# EAGLE design 712_universal_i2c_long (EAGLE 9.6.2)
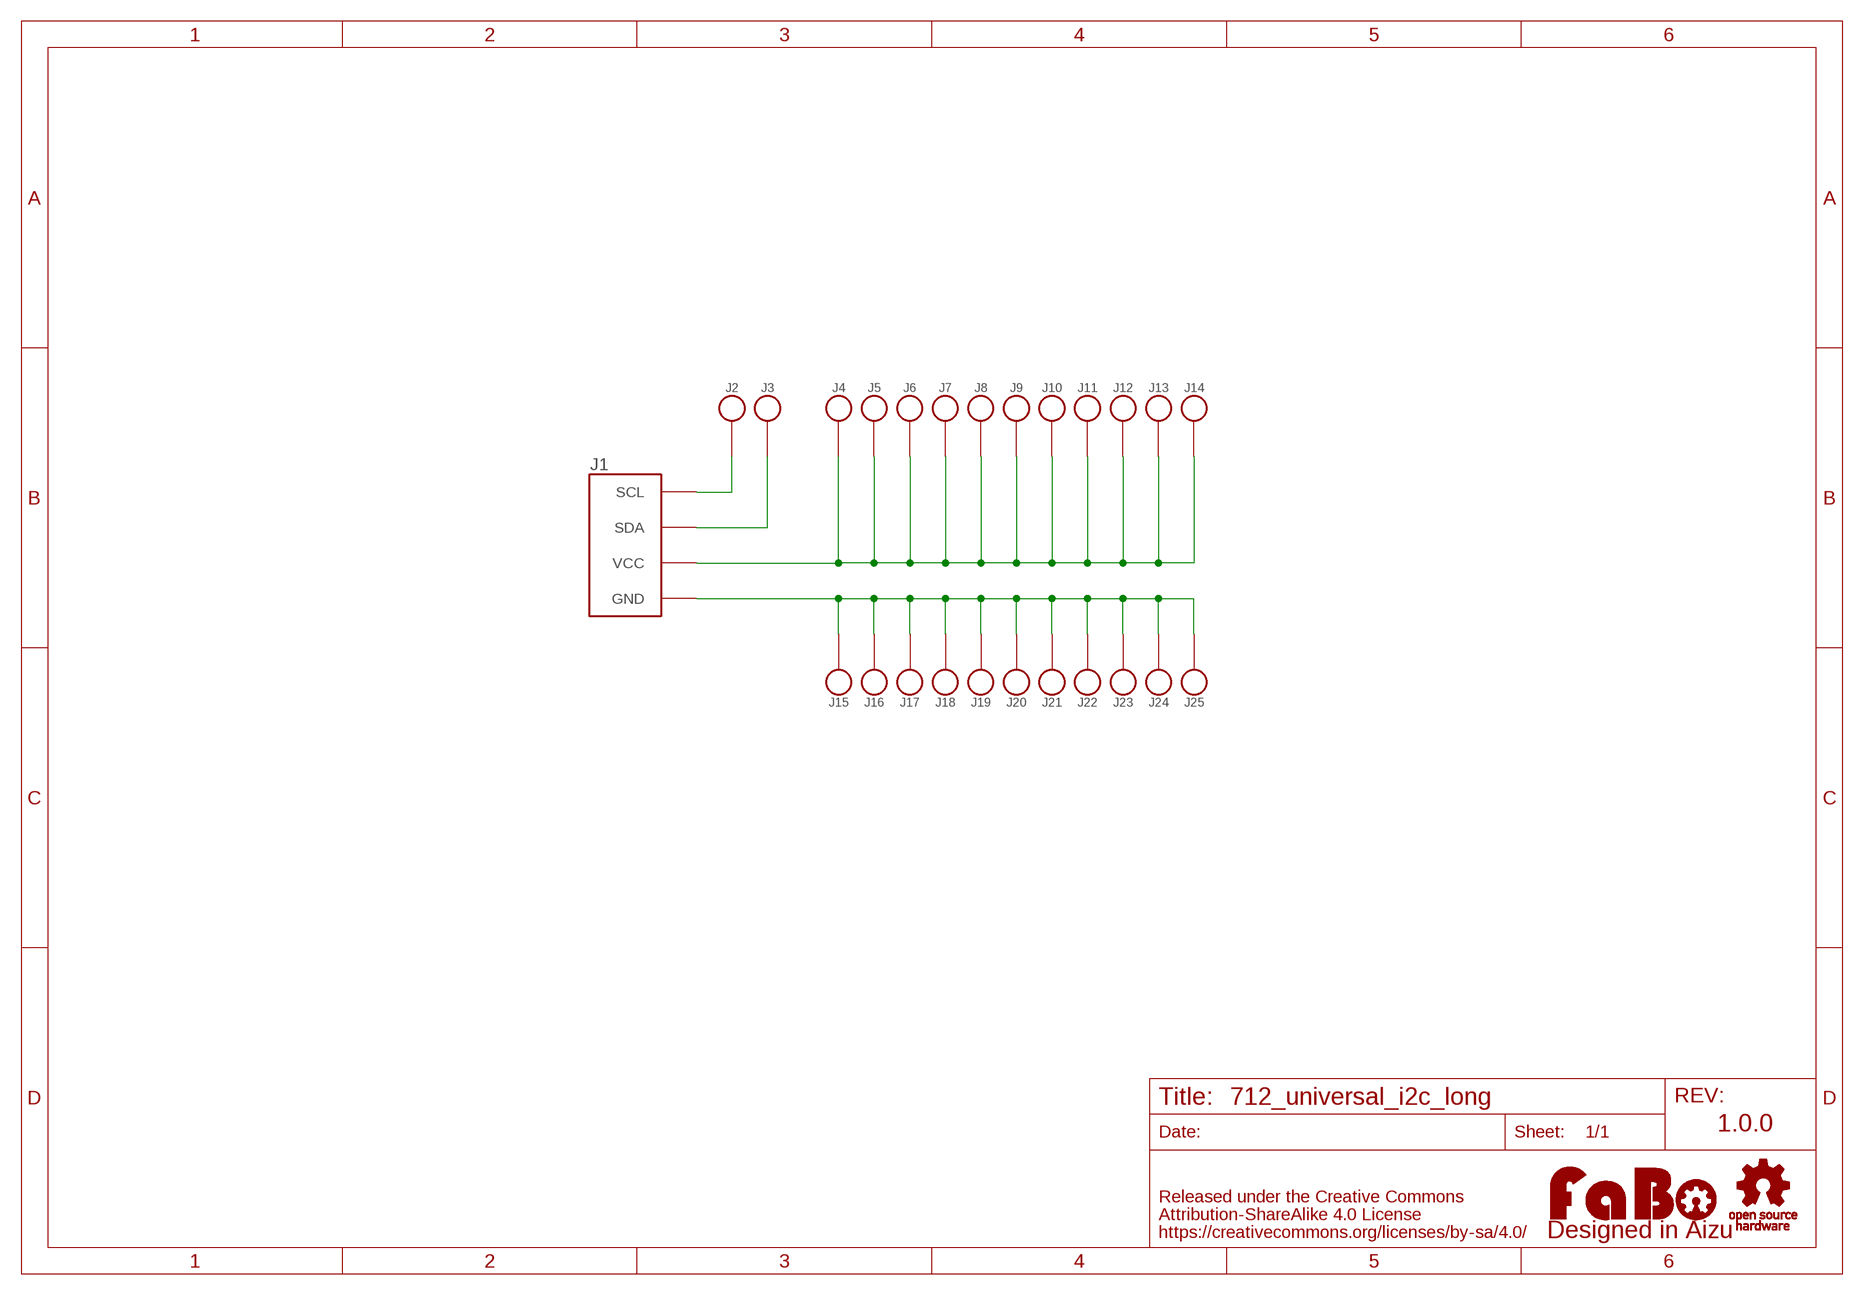
[diagram p0: schematic, sheet 1]

## Parts
J1  FABO_BRICK_I2C-UNIVERSAL_LONG  [FABO_BRICK_I2C_UNIVERSAL_LONG]
J2  PIN_HEADER_1X1_NOLABEL  [PIN_1X1_NOLABEL]
J3  PIN_HEADER_1X1_NOLABEL  [PIN_1X1_NOLABEL]
J4  PIN_HEADER_1X1_NOLABEL  [PIN_1X1_NOLABEL]
J5  PIN_HEADER_1X1_NOLABEL  [PIN_1X1_NOLABEL]
J6  PIN_HEADER_1X1_NOLABEL  [PIN_1X1_NOLABEL]
J7  PIN_HEADER_1X1_NOLABEL  [PIN_1X1_NOLABEL]
J8  PIN_HEADER_1X1_NOLABEL  [PIN_1X1_NOLABEL]
J9  PIN_HEADER_1X1_NOLABEL  [PIN_1X1_NOLABEL]
J10  PIN_HEADER_1X1_NOLABEL  [PIN_1X1_NOLABEL]
J11  PIN_HEADER_1X1_NOLABEL  [PIN_1X1_NOLABEL]
J12  PIN_HEADER_1X1_NOLABEL  [PIN_1X1_NOLABEL]
J13  PIN_HEADER_1X1_NOLABEL  [PIN_1X1_NOLABEL]
J14  PIN_HEADER_1X1_NOLABEL  [PIN_1X1_NOLABEL]
J15  PIN_HEADER_1X1_NOLABEL  [PIN_1X1_NOLABEL]
J16  PIN_HEADER_1X1_NOLABEL  [PIN_1X1_NOLABEL]
J17  PIN_HEADER_1X1_NOLABEL  [PIN_1X1_NOLABEL]
J18  PIN_HEADER_1X1_NOLABEL  [PIN_1X1_NOLABEL]
J19  PIN_HEADER_1X1_NOLABEL  [PIN_1X1_NOLABEL]
J20  PIN_HEADER_1X1_NOLABEL  [PIN_1X1_NOLABEL]
J21  PIN_HEADER_1X1_NOLABEL  [PIN_1X1_NOLABEL]
J22  PIN_HEADER_1X1_NOLABEL  [PIN_1X1_NOLABEL]
J23  PIN_HEADER_1X1_NOLABEL  [PIN_1X1_NOLABEL]
J24  PIN_HEADER_1X1_NOLABEL  [PIN_1X1_NOLABEL]
J25  PIN_HEADER_1X1_NOLABEL  [PIN_1X1_NOLABEL]
U$2  LOGO_OSHW-M_BOTTOM  [LOGO_OSHW_M_BOTTOM]
U$3  LOGO_FABO-M  [LOGO_FABO_MS]

## Nets
GND: J1.GND J15.1 J16.1 J17.1 J18.1 J19.1 J20.1 J21.1 J22.1 J23.1 J24.1 J25.1
RX: J1.SCL J2.1
TX: J1.SDA J3.1
VCC: J1.VCC J4.1 J5.1 J6.1 J7.1 J8.1 J9.1 J10.1 J11.1 J12.1 J13.1 J14.1

## Notes on the sheet
- 1.0.0

## Library data of the parts
J1 = FaBo-Template:FABO_BRICK_I2C: FaBo Brick I2C
J2-J25 = FaBo-PIN:PIN_HEADER_1X1_NOLABEL
U$2 = FaBo-etc:LOGO_OSHW
U$3 = FaBo-Logo:LOGO_FABO

## Board
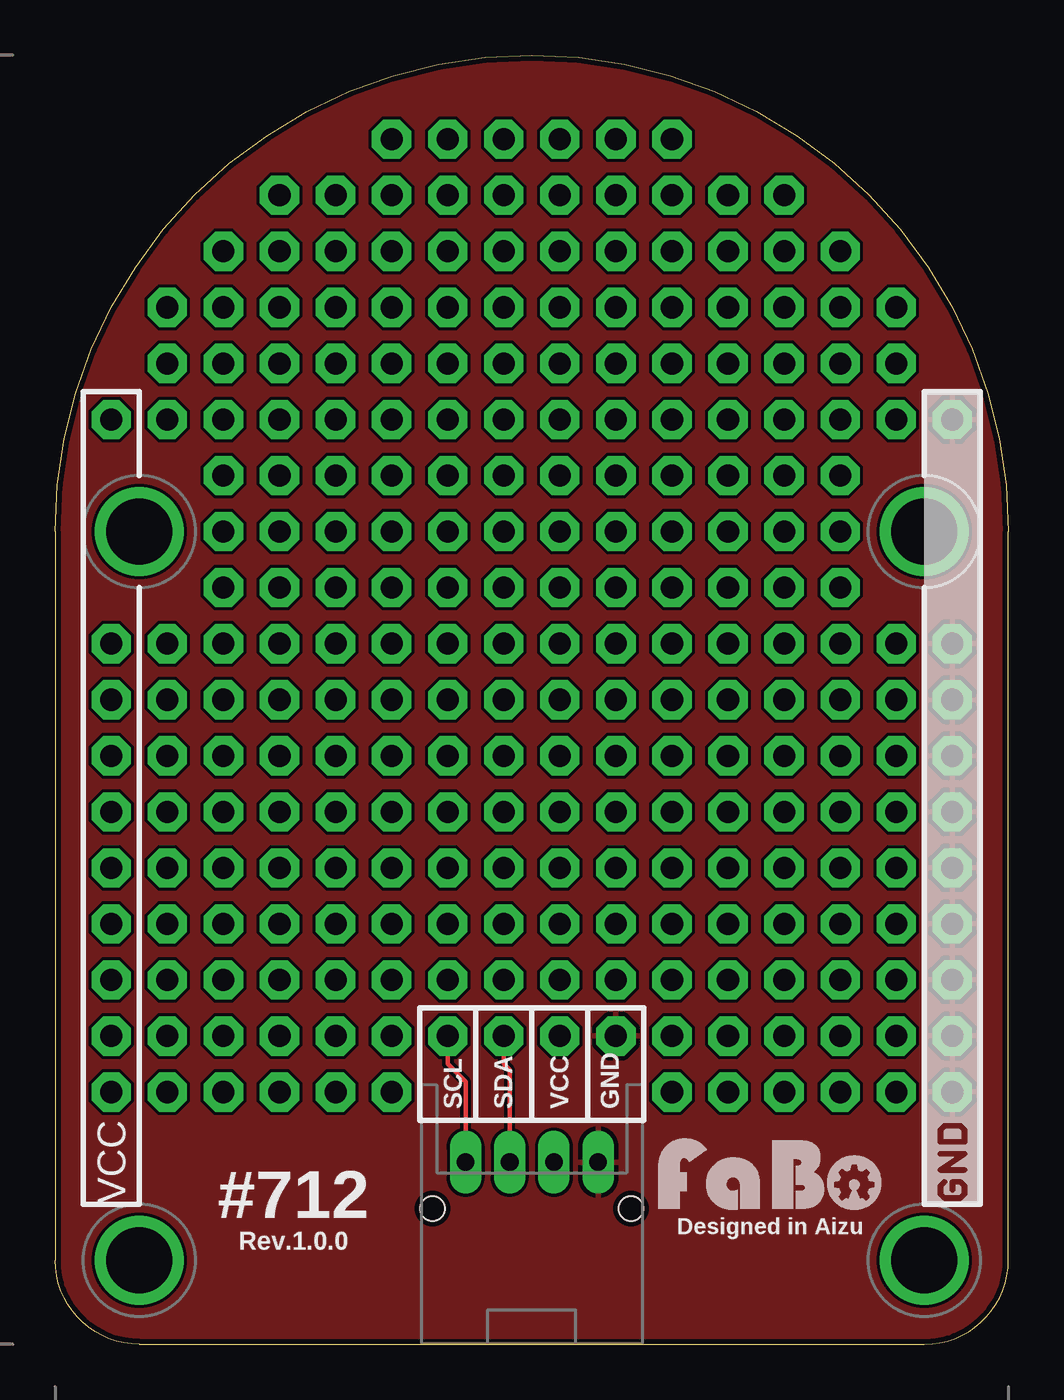
[diagram p1: board, top side]
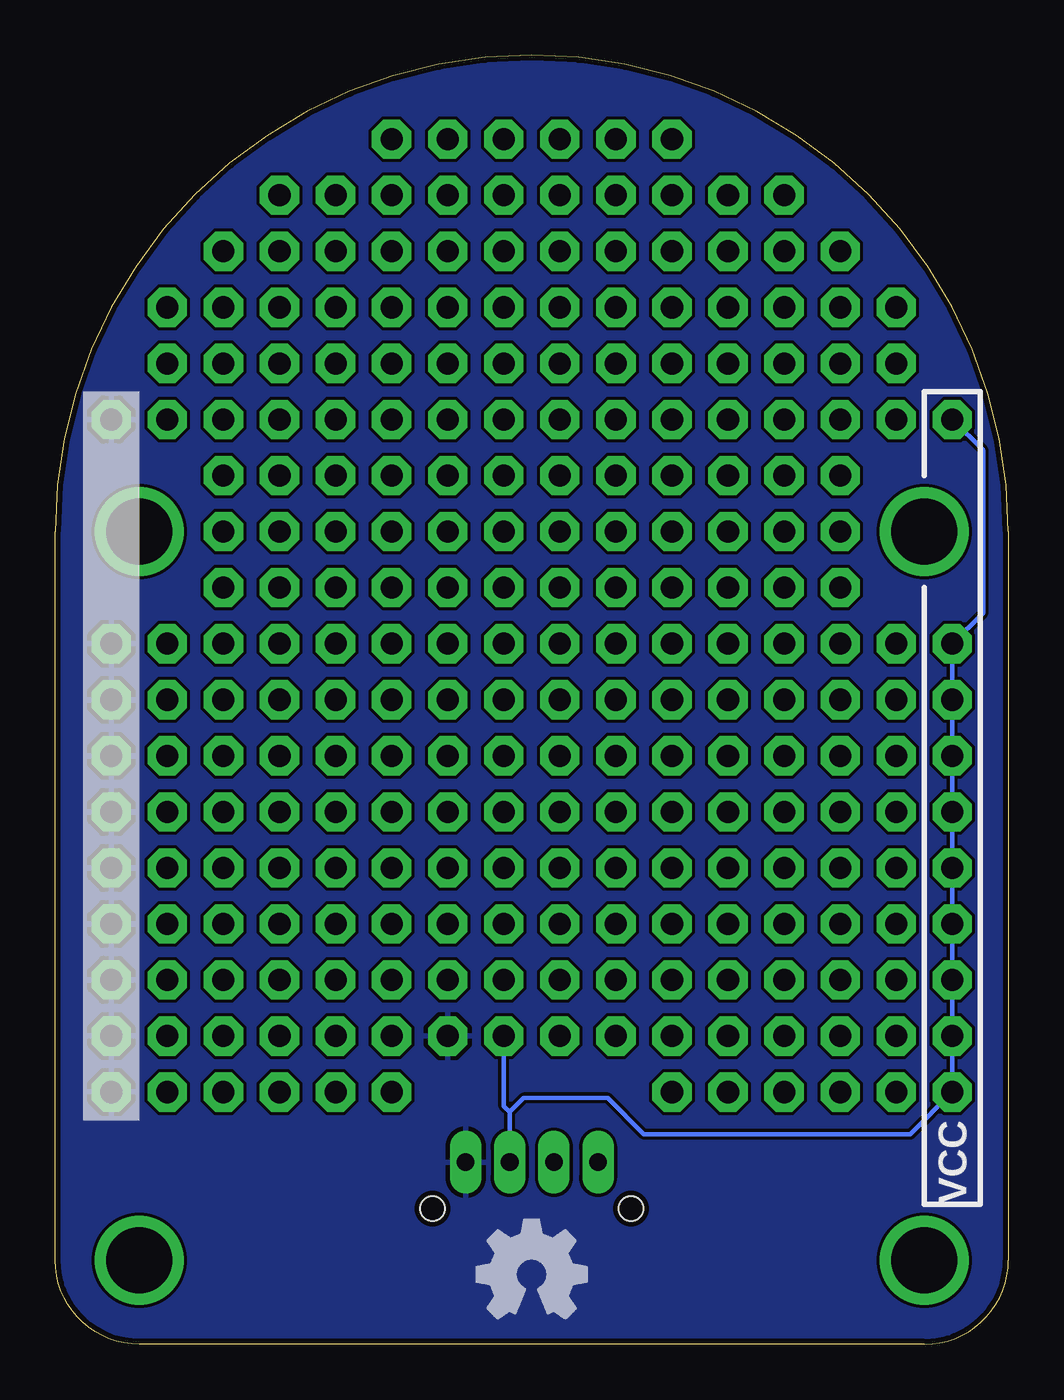
[diagram p2: board, bottom side, seen from below]

Size 43.18 x 58.42 mm. Coordinates in mm from the lower left corner, seen from the top.
Copper layers (1*16): Top 0.035mm / dielectric 1.6mm / Bottom 0.035mm
Design rules "PCBway": minimum track width 6mil, minimum drill 12mil, track to track 6mil, track to pad 6mil, pad to pad 6mil, via to via 6mil, smd to smd 6mil, copper to edge 10mil, drill to drill 10mil, minimum pad ring 10mil, minimum via ring 6mil, stop-mask expansion 2mil, vias tented up to drill 100mil, thermal gap 8mil

### Footprints (pad centres in the part's own frame; a part is rotated, then mirrored left to right if it is on the bottom)
FABO_BRICK_I2C_UNIVERSAL_LONG = drill 0.8 pad 1.422 long: GND 3,-20.955; SCL -3,-20.955; SDA -1,-20.955; VCC 1,-20.955 | drill 3 pad 3.81: P$1 -17.78,7.62; P$2 17.78,7.62; P$3 -17.78,-25.4; P$4 17.78,-25.4 | drill 1 pad 1.778 octagon: P$5 -13.97,-17.78; P$6 -6.35,-17.78; P$7 6.35,-5.08; P$8 8.89,-5.08; P$9 8.89,-2.54; P$10 -8.89,-17.78; P$11 -11.43,-15.24; P$12 -13.97,-15.24; P$13 13.97,-17.78; P$14 -11.43,-17.78; P$15 -8.89,-15.24; P$16 -6.35,-15.24; P$17 13.97,-15.24; P$18 13.97,-12.7; P$19 13.97,-10.16; P$20 13.97,-7.62; P$21 -13.97,-12.7; P$22 -13.97,-10.16; P$23 -13.97,-7.62; P$24 -11.43,-12.7; P$25 -11.43,-10.16; P$26 -11.43,-7.62; P$27 -8.89,-12.7; P$28 -8.89,-10.16; P$29 -8.89,-7.62; P$30 -6.35,-12.7; P$31 -3.81,-12.7; P$32 -1.27,-12.7; P$33 1.27,-12.7; P$34 13.97,-5.08; P$35 -6.35,-10.16; P$36 -3.81,-10.16; P$37 -1.27,-10.16; P$38 1.27,-10.16; P$39 13.97,-2.54; P$40 -6.35,-7.62; P$41 -3.81,-7.62; P$42 -1.27,-7.62; P$43 1.27,-7.62; P$44 1.27,0; P$45 -1.27,-5.08; P$46 -3.81,-5.08; P$47 -6.35,-5.08; P$48 -8.89,-5.08; P$49 -11.43,-5.08; P$50 -13.97,-5.08; P$51 -13.97,-2.54; P$52 -11.43,-2.54; P$53 -8.89,-2.54; P$54 -6.35,-2.54; P$55 -3.81,-2.54; P$56 -1.27,-2.54; P$57 8.89,-7.62; P$58 6.35,-7.62; P$59 3.81,0; P$60 8.89,-10.16; P$61 8.89,-12.7; P$62 8.89,-15.24; P$63 8.89,-17.78; P$64 -13.97,0; P$65 6.35,-10.16; P$66 6.35,0; P$67 6.35,-12.7; P$68 6.35,-15.24; P$69 6.35,-17.78; P$70 3.81,-7.62; P$71 3.81,-10.16; P$72 3.81,-12.7; P$73 13.97,0; P$74 6.35,-2.54; P$75 -8.89,0; P$76 1.27,-2.54; P$77 3.81,-2.54; P$78 3.81,-5.08; P$79 1.27,-5.08; P$80 -1.27,0; P$81 13.97,2.54; P$82 13.97,5.08; P$83 -11.43,0; P$84 -6.35,0; P$85 -3.81,0; P$86 13.97,7.62; P$87 8.89,0; P$88 -13.97,2.54; P$89 -13.97,5.08; P$90 -13.97,7.62; P$91 13.97,17.78; P$92 11.43,22.86; P$93 13.97,20.32; P$94 -11.43,2.54; P$95 -11.43,5.08; P$96 -11.43,7.62; P$97 -8.89,2.54; P$98 -8.89,5.08; P$99 -8.89,7.62; P$100 -6.35,2.54; P$101 -6.35,5.08; P$102 -6.35,7.62; P$103 -3.81,2.54; P$104 -3.81,5.08; P$105 -3.81,7.62; P$106 -1.27,2.54; P$107 -1.27,5.08; P$108 -1.27,7.62; P$109 1.27,2.54; P$110 1.27,5.08; P$111 1.27,7.62; P$112 3.81,2.54; P$113 3.81,5.08; P$114 3.81,7.62; P$115 6.35,2.54; P$116 6.35,5.08; P$117 6.35,7.62; P$118 8.89,2.54; P$119 8.89,5.08; P$120 8.89,7.62; P$121 6.35,10.16; P$122 6.35,12.7; P$123 6.35,15.24; P$124 6.35,17.78; P$125 6.35,20.32; P$126 6.35,22.86; P$127 8.89,15.24; P$128 8.89,17.78; P$129 8.89,20.32; P$130 3.81,10.16; P$131 3.81,12.7; P$132 3.81,15.24; P$133 3.81,17.78; P$134 3.81,20.32; P$135 3.81,22.86; P$136 -6.35,10.16; P$137 1.27,10.16; P$138 1.27,12.7; P$139 1.27,15.24; P$140 1.27,17.78; P$141 1.27,20.32; P$142 1.27,22.86; P$143 1.27,25.4; P$144 -1.27,10.16; P$145 -1.27,12.7; P$146 -1.27,15.24; P$147 -1.27,17.78; P$148 -1.27,20.32; P$149 -1.27,22.86; P$150 -1.27,25.4; P$151 -3.81,10.16; P$152 -3.81,12.7; P$153 -3.81,15.24; P$154 -3.81,17.78; P$155 -3.81,20.32; P$156 -3.81,22.86; P$157 -3.81,25.4; P$158 -6.35,12.7; P$159 -6.35,15.24; P$160 -6.35,17.78; P$161 -6.35,20.32; P$162 -6.35,22.86; P$163 -6.35,25.4; P$164 -8.89,10.16; P$165 -8.89,12.7; P$166 -8.89,15.24; P$167 -8.89,17.78; P$168 -8.89,20.32; P$169 -8.89,22.86; P$170 13.97,10.16; P$171 -11.43,10.16; P$172 -11.43,12.7; P$173 -11.43,15.24; P$174 -11.43,17.78; P$175 -11.43,20.32; P$176 13.97,12.7; P$177 -13.97,10.16; P$178 -13.97,12.7; P$179 -13.97,15.24; P$180 -13.97,17.78; P$181 13.97,15.24; P$182 11.43,2.54; P$183 -13.97,20.32; P$184 -11.43,22.86; P$185 11.43,-5.08; P$186 11.43,-17.78; P$187 16.51,-17.78; P$188 11.43,15.24; P$189 11.43,-12.7; P$190 11.43,17.78; P$191 11.43,-15.24; P$192 11.43,20.32; P$193 11.43,-2.54; P$194 11.43,7.62; P$195 11.43,-10.16; P$196 11.43,5.08; P$197 11.43,-7.62; P$198 8.89,12.7; P$199 11.43,12.7; P$200 8.89,10.16; P$201 11.43,10.16; P$202 8.89,22.86; P$203 11.43,0; P$204 3.81,25.4; P$205 6.35,25.4; P$206 16.51,-15.24; P$207 16.51,-12.7; P$208 16.51,-10.16; P$209 16.51,-7.62; P$210 16.51,-5.08; P$211 16.51,-2.54; P$212 16.51,0; P$213 16.51,2.54; P$214 16.51,12.7; P$215 16.51,15.24; P$216 16.51,17.78; P$217 -16.51,-17.78; P$218 -16.51,-15.24; P$219 -16.51,-12.7; P$220 -16.51,-10.16; P$221 -16.51,-7.62; P$222 -16.51,-5.08; P$223 -16.51,-2.54; P$224 -16.51,0; P$225 -16.51,2.54; P$226 -16.51,12.7; P$227 -16.51,15.24; P$228 -16.51,17.78 | hole 1.1: -4.5,-23.055; 4.5,-23.055
PIN_1X1_NOLABEL = drill 1 pad 1.778 octagon: 1 0,0

### Placement (x,y rotation side)
J1  21.59,29.21 0 top
J2  17.78,13.97 0 top
J3  20.32,13.97 0 top
J4  22.86,13.97 0 top
J5  2.54,11.43 0 top
J6  2.54,13.97 0 top
J7  2.54,16.51 0 top
J8  2.54,19.05 0 top
J9  2.54,21.59 0 top
J10  2.54,24.13 0 top
J11  2.54,26.67 0 top
J12  2.54,29.21 0 top
J13  2.54,31.75 0 top
J14  2.54,41.91 0 top
J15  25.4,13.97 0 top
J16  40.64,11.43 0 top
J17  40.64,13.97 0 top
J18  40.64,16.51 0 top
J19  40.64,19.05 0 top
J20  40.64,21.59 0 top
J21  40.64,24.13 0 top
J22  40.64,26.67 0 top
J23  40.64,29.21 0 top
J24  40.64,31.75 0 top
J25  40.64,41.91 0 top
U$2  21.59,3.17 0 top
U$3  32.38,5.71 0 top
U$4  [LOGO_SILK_GND]  41.91,6.35 90 top

### Tracks (layer width: path | path; a pad name or v marks a point on that pad's centre or on a via)
GND
  pour Bottom: 0,0 43.18,0 43.18,58.42 0,58.42
  pour Top: 0,0 43.18,0 43.18,58.42 0,58.42
RX
  Top 0.203: J2.1 17.78,12.7 18.59,11.89 J1.SCL
TX
  Top 0.203: J3.1 20.32,12.7 20.59,12.43 J1.SDA
VCC
  Bottom 0.203: 22.59,10.53 22.86,10.79 J4.1 | 22.59,10.53 21.95,11.16 18.14,11.16 16.51,9.53 4.45,9.53 J5.1 J6.1 J7.1 J8.1 J9.1 J10.1 J11.1 J12.1 J13.1 1.14,33.15 1.14,40.51 J14.1 | J1.VCC 22.59,10.53

### Text on the board
tPlace: SCL | SDA | VCC | GND | VCC | #712 | Designed in Aizu | Rev.1.0.0
bPlace: VCC